# EAGLE schematic Cube_Schematic (EAGLE 6.1)
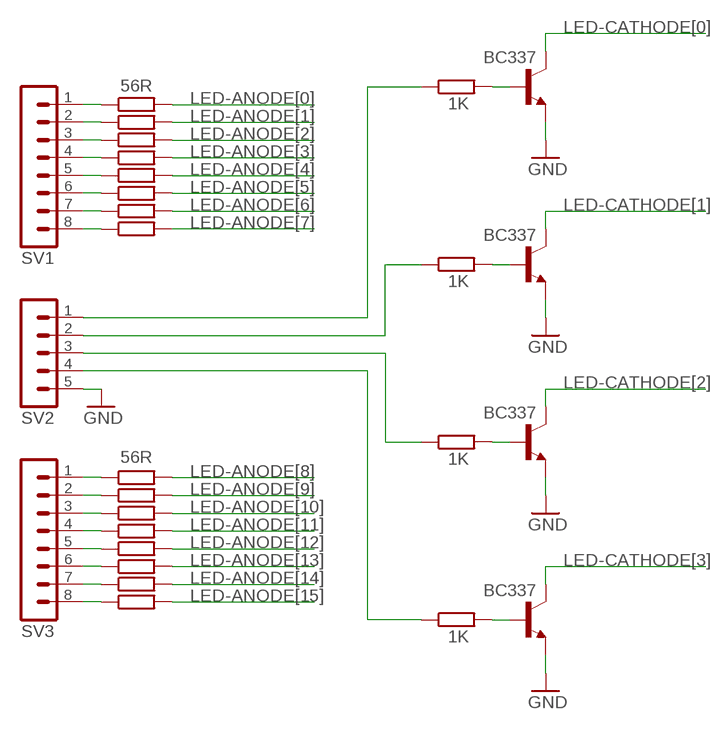
[diagram p0: schematic, sheet 1]

## Parts
R1  56R  R-EU_0204/7  [0204/7]
R2  56R  R-EU_0204/7  [0204/7]
R3  56R  R-EU_0204/7  [0204/7]
R4  56R  R-EU_0204/7  [0204/7]
R5  56R  R-EU_0204/7  [0204/7]
R6  56R  R-EU_0204/7  [0204/7]
R7  56R  R-EU_0204/7  [0204/7]
R8  56R  R-EU_0204/7  [0204/7]
R9  56R  R-EU_0204/7  [0204/7]
R10  56R  R-EU_0204/7  [0204/7]
R11  56R  R-EU_0204/7  [0204/7]
R12  56R  R-EU_0204/7  [0204/7]
R13  56R  R-EU_0204/7  [0204/7]
R14  56R  R-EU_0204/7  [0204/7]
R15  56R  R-EU_0204/7  [0204/7]
R16  56R  R-EU_0204/7  [0204/7]
R17  1K  R-EU_0204/7  [0204/7]
R18  1K  R-EU_0204/7  [0204/7]
R19  1K  R-EU_0204/7  [0204/7]
R20  1K  R-EU_0204/7  [0204/7]
SV1  MA08-1  [MA08-1]
SV2  MA05-1  [MA05-1]
SV3  MA08-1  [MA08-1]
T1  BC337  [TO92]
T2  BC337  [TO92]
T3  BC337  [TO92]
T4  BC337  [TO92]

## Nets
GND: SV2.5 T1.1(E) T2.1(E) T3.1(E) T4.1(E)
LED-ANODE[0]: R1.2
LED-ANODE[1]: R2.2
LED-ANODE[2]: R3.2
LED-ANODE[3]: R4.2
LED-ANODE[4]: R5.2
LED-ANODE[5]: R6.2
LED-ANODE[6]: R7.2
LED-ANODE[7]: R8.2
LED-ANODE[8]: R9.2
LED-ANODE[9]: R10.2
LED-ANODE[10]: R11.2
LED-ANODE[11]: R12.2
LED-ANODE[12]: R13.2
LED-ANODE[13]: R14.2
LED-ANODE[14]: R15.2
LED-ANODE[15]: R16.2
LED-CATHODE[0]: T1.3(C)
LED-CATHODE[1]: T2.3(C)
LED-CATHODE[2]: T3.3(C)
LED-CATHODE[3]: T4.3(C)
N$1: R1.1 SV1.1
N$2: R2.1 SV1.2
N$3: R3.1 SV1.3
N$4: R4.1 SV1.4
N$5: R5.1 SV1.5
N$6: R6.1 SV1.6
N$7: R7.1 SV1.7
N$8: R8.1 SV1.8
N$9: R9.1 SV3.1
N$10: R10.1 SV3.2
N$11: R11.1 SV3.3
N$12: R12.1 SV3.4
N$13: R13.1 SV3.5
N$14: R14.1 SV3.6
N$15: R15.1 SV3.7
N$16: R16.1 SV3.8
N$17: R17.2 T1.2(B)
N$18: R18.2 T2.2(B)
N$19: R19.2 T3.2(B)
N$20: R20.2 T4.2(B)
N$21: R17.1 SV2.1
N$22: R18.1 SV2.2
N$23: R19.1 SV2.3
N$24: R20.1 SV2.4

## Library data of the parts
R1-R16 = resistor:R-EU_: RESISTOR, European symbol
R17-R20 = rcl:R-EU_: RESISTOR, European symbol
SV1 SV3 = con-lstb:MA08-1: PIN HEADER
SV2 = con-lstb:MA05-1: PIN HEADER
T1-T4 = transistor:BC337: NPN TRANSISTOR